# Altium schematic sheet AIO.SchDoc
size A4; DrawnBy: Copyright © 2023 by; Engineer: Artyom Kislevitz Lee; Revision: A
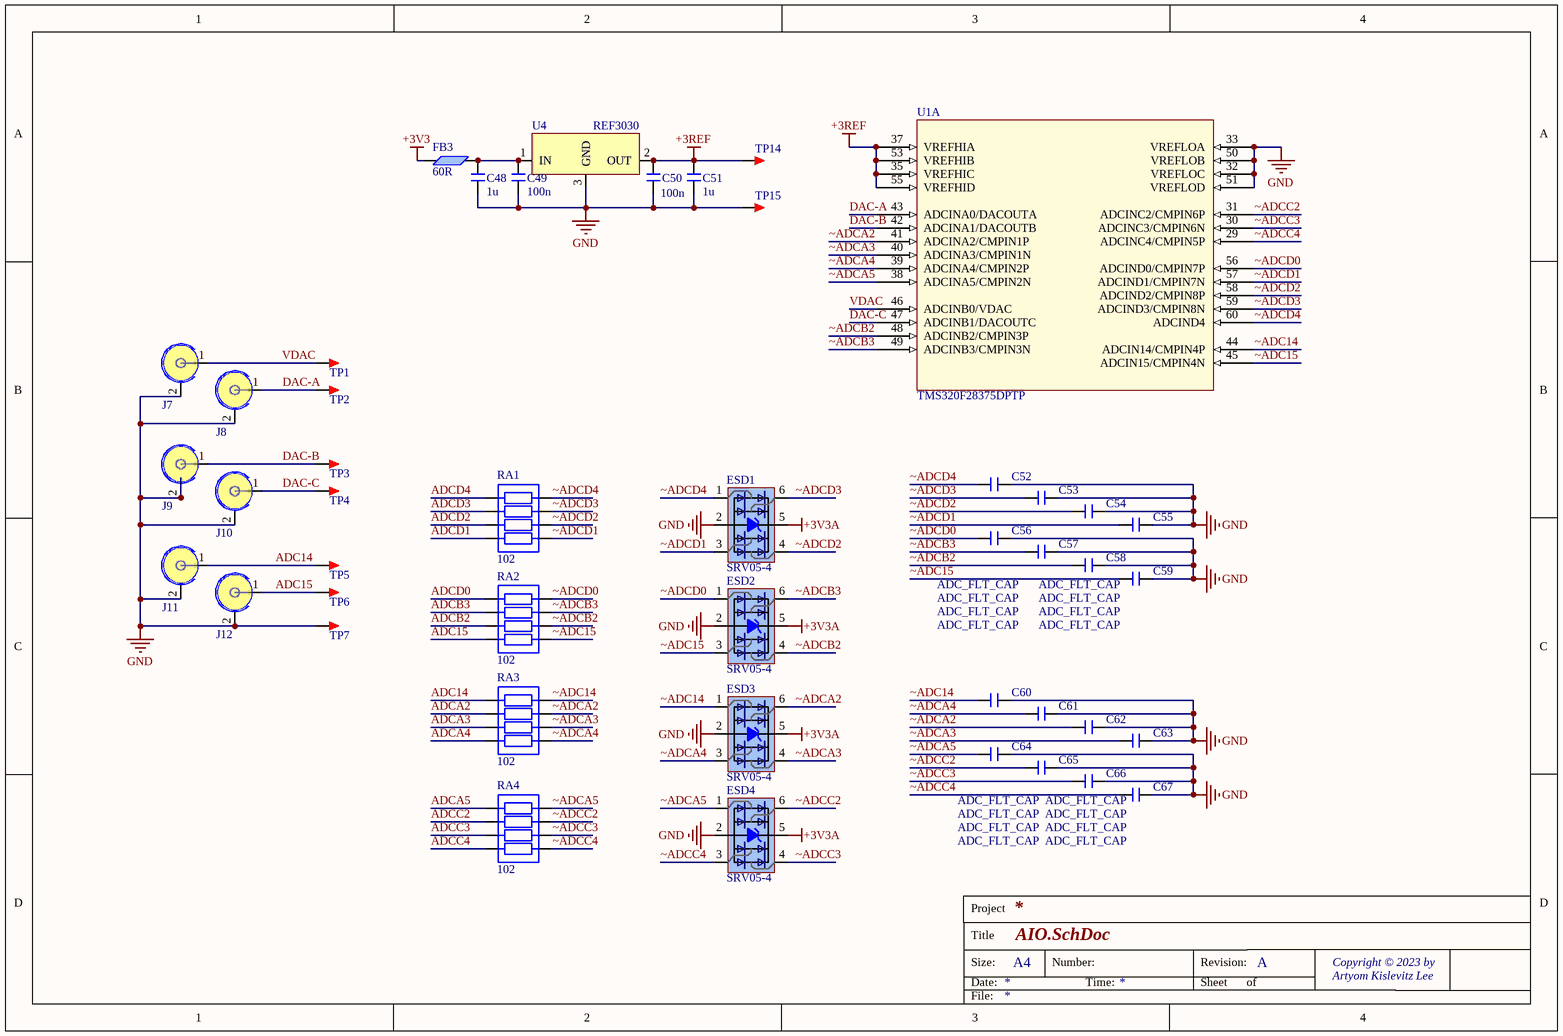
[diagram p0: AIO.SchDoc]

## Parts
C48  1u  [C 0805_L]
C49  100n  [C 0805_L]
C50  100n  [C 0805_L]
C51  1u  [C 0805_L]
C52  ADC_FLT_CAP  [C 0805_L]
C53  ADC_FLT_CAP  [C 0805_L]
C54  ADC_FLT_CAP  [C 0805_L]
C55  ADC_FLT_CAP  [C 0805_L]
C56  ADC_FLT_CAP  [C 0805_L]
C57  ADC_FLT_CAP  [C 0805_L]
C58  ADC_FLT_CAP  [C 0805_L]
C59  ADC_FLT_CAP  [C 0805_L]
C60  ADC_FLT_CAP  [C 0805_L]
C61  ADC_FLT_CAP  [C 0805_L]
C62  ADC_FLT_CAP  [C 0805_L]
C63  ADC_FLT_CAP  [C 0805_L]
C64  ADC_FLT_CAP  [C 0805_L]
C65  ADC_FLT_CAP  [C 0805_L]
C66  ADC_FLT_CAP  [C 0805_L]
C67  ADC_FLT_CAP  [C 0805_L]
ESD1  SRV05-4  [SOT23-6L]
ESD2  SRV05-4  [SOT23-6L]
ESD3  SRV05-4  [SOT23-6L]
ESD4  SRV05-4  [SOT23-6L]
FB3  60R  [R 0805_L]
J7  射频连接器  [IPEX-1]  (value not drawn)
J8  射频连接器  [IPEX-1]  (value not drawn)
J9  射频连接器  [IPEX-1]  (value not drawn)
J10  射频连接器  [IPEX-1]  (value not drawn)
J11  射频连接器  [IPEX-1]  (value not drawn)
J12  射频连接器  [IPEX-1]  (value not drawn)
RA1  102  [RCA-8P4R-0603]
RA2  102  [RCA-8P4R-0603]
RA3  102  [RCA-8P4R-0603]
RA4  102  [RCA-8P4R-0603]
TP1  TEST TP  [TEST TP1.4_W]  (value not drawn)
TP2  TEST TP  [TEST TP1.4_Y]  (value not drawn)
TP3  TEST TP  [TEST TP1.4_Y]  (value not drawn)
TP4  TEST TP  [TEST TP1.4_Y]  (value not drawn)
TP5  TEST TP  [TEST TP1.4_G]  (value not drawn)
TP6  TEST TP  [TEST TP1.4_G]  (value not drawn)
TP7  TEST TP  [TEST TP1.4_B]  (value not drawn)
TP14  TEST  [TEST 1.6]  (value not drawn)
TP15  TEST  [TEST 1.6]  (value not drawn)
U1  TMS320F28375DPTP  [LQFP176-E 24x24_N]  (part A of 5)
U4  REF3030  [SOT23-3L]

## Nets
+3REF: C50.2 C51.2 TP14.1 U1.35(VREFHIC) U1.37(VREFHIA) U1.53(VREFHIB) U1.55(VREFHID) U4.2(OUT)
+3V3: FB3.1
+3V3A: ESD1.5(EPAD) ESD2.5(EPAD) ESD3.5(EPAD) ESD4.5(EPAD)
GND: C48.1 C49.1 C50.1 C51.1 C52.1 C53.1 C54.1 C55.1 C56.1 C57.1 C58.1 C59.1 C60.1 C61.1 C62.1 C63.1 C64.1 C65.1 C66.1 C67.1 ESD1.2(EPAD) ESD2.2(EPAD) ESD3.2(EPAD) ESD4.2(EPAD) J7.2(GND) J8.2(GND) J9.2(GND) J10.2(GND) J11.2(GND) J12.2(GND) TP7.1 TP15.1 U1.32(VREFLOC) U1.33(VREFLOA) U1.50(VREFLOB) U1.51(VREFLOD) U4.3(GND)
ADC14: J11.1(SIG) RA3.8 TP5.1
ADC15: J12.1(SIG) RA2.5 TP6.1
ADCA2: RA3.7
ADCA3: RA3.6
ADCA4: RA3.5
ADCA5: RA4.8
ADCB2: RA2.6
ADCB3: RA2.7
ADCC2: RA4.7
ADCC3: RA4.6
ADCC4: RA4.5
ADCD0: RA2.8
ADCD1: RA1.5
ADCD2: RA1.6
ADCD3: RA1.7
ADCD4: RA1.8
DAC-A: J8.1(SIG) TP2.1 U1.43(ADCINA0/DACOUTA)
DAC-B: J9.1(SIG) TP3.1 U1.42(ADCINA1/DACOUTB)
DAC-C: J10.1(SIG) TP4.1 U1.47(ADCINB1/DACOUTC)
VDAC: J7.1(SIG) TP1.1 U1.46(ADCINB0/VDAC)
~ADC14: C60.2 ESD3.1(EPAD) RA3.1 U1.44(ADCIN14/CMPIN4P)
~ADC15: C59.2 ESD2.3(EPAD) RA2.4 U1.45(ADCIN15/CMPIN4N)
~ADCA2: C62.2 ESD3.6(EPAD) RA3.2 U1.41(ADCINA2/CMPIN1P)
~ADCA3: C63.2 ESD3.4(EPAD) RA3.3 U1.40(ADCINA3/CMPIN1N)
~ADCA4: C61.2 ESD3.3(EPAD) RA3.4 U1.39(ADCINA4/CMPIN2P)
~ADCA5: C64.2 ESD4.1(EPAD) RA4.1 U1.38(ADCINA5/CMPIN2N)
~ADCB2: C58.2 ESD2.4(EPAD) RA2.3 U1.48(ADCINB2/CMPIN3P)
~ADCB3: C57.2 ESD2.6(EPAD) RA2.2 U1.49(ADCINB3/CMPIN3N)
~ADCC2: C65.2 ESD4.6(EPAD) RA4.2 U1.31(ADCINC2/CMPIN6P)
~ADCC3: C66.2 ESD4.4(EPAD) RA4.3 U1.30(ADCINC3/CMPIN6N)
~ADCC4: C67.2 ESD4.3(EPAD) RA4.4 U1.29(ADCINC4/CMPIN5P)
~ADCD0: C56.2 ESD2.1(EPAD) RA2.1 U1.56(ADCIND0/CMPIN7P)
~ADCD1: C55.2 ESD1.3(EPAD) RA1.4 U1.57(ADCIND1/CMPIN7N)
~ADCD2: C54.2 ESD1.4(EPAD) RA1.3 U1.58(ADCIND2/CMPIN8P)
~ADCD3: C53.2 ESD1.6(EPAD) RA1.2 U1.59(ADCIND3/CMPIN8N)
~ADCD4: C52.2 ESD1.1(EPAD) RA1.1 U1.60(ADCIND4)
NetC48_2: C48.2 C49.2 FB3.2 U4.1(IN)

## Notes on the sheet
- Project
- Title
- Size:
- Date:
- A4
- Number:
- Time:
- Revision:
- Sheet
- of
- Copyright © 2023 by
- Artyom Kislevitz Lee
- File:

## Library data of the parts
C48-C67 = C: 贴片电容; 淘宝ID: 小糖豆的小窝窝; BOM名称: 贴片电容; 下单链接: https://item.taobao.com/item.htm?ft=t&id=613637044352
ESD1-ESD4 = ESD - 4
FB3 = FB: 磁珠; BOM名称: 贴片磁珠
J7-J12 = 射频连接器: 射频连接器 RF connector
RA1-RA4 = R-8P4R: 贴片排阻; 淘宝ID: 小糖豆的小窝窝; BOM名称: 贴片排阻; 下单链接: https://item.taobao.com/item.htm?ft=t&id=613637044352
TP1-TP7 = TEST TP: 测试环; 淘宝ID: 小糖豆的小窝窝; BOM名称: 测试环; 下单链接: https://item.taobao.com/item.htm?ft=t&id=613637044352
TP14 TP15 = TEST: 测试点; 淘宝ID: 小糖豆的小窝窝; BOM名称: 测试点; 下单链接: https://item.taobao.com/item.htm?ft=t&id=613637044352
U1 = TMS320F28377DPTP: DSP 176; Manufacturer: Texas Instruments; CompType: IC; PIN_COUNT: 177; PartNumber: TMS320F28377DPTP; PackageReference: PTP0176F; MountType: SMT; RoHS: Y; RefDes: RefDes; Type: DEV; Value: Value